# Altium schematic sheet Permanent_Storage.SchDoc
size 594 x 420 mm; SheetNumber: 1; SheetTotal: 4
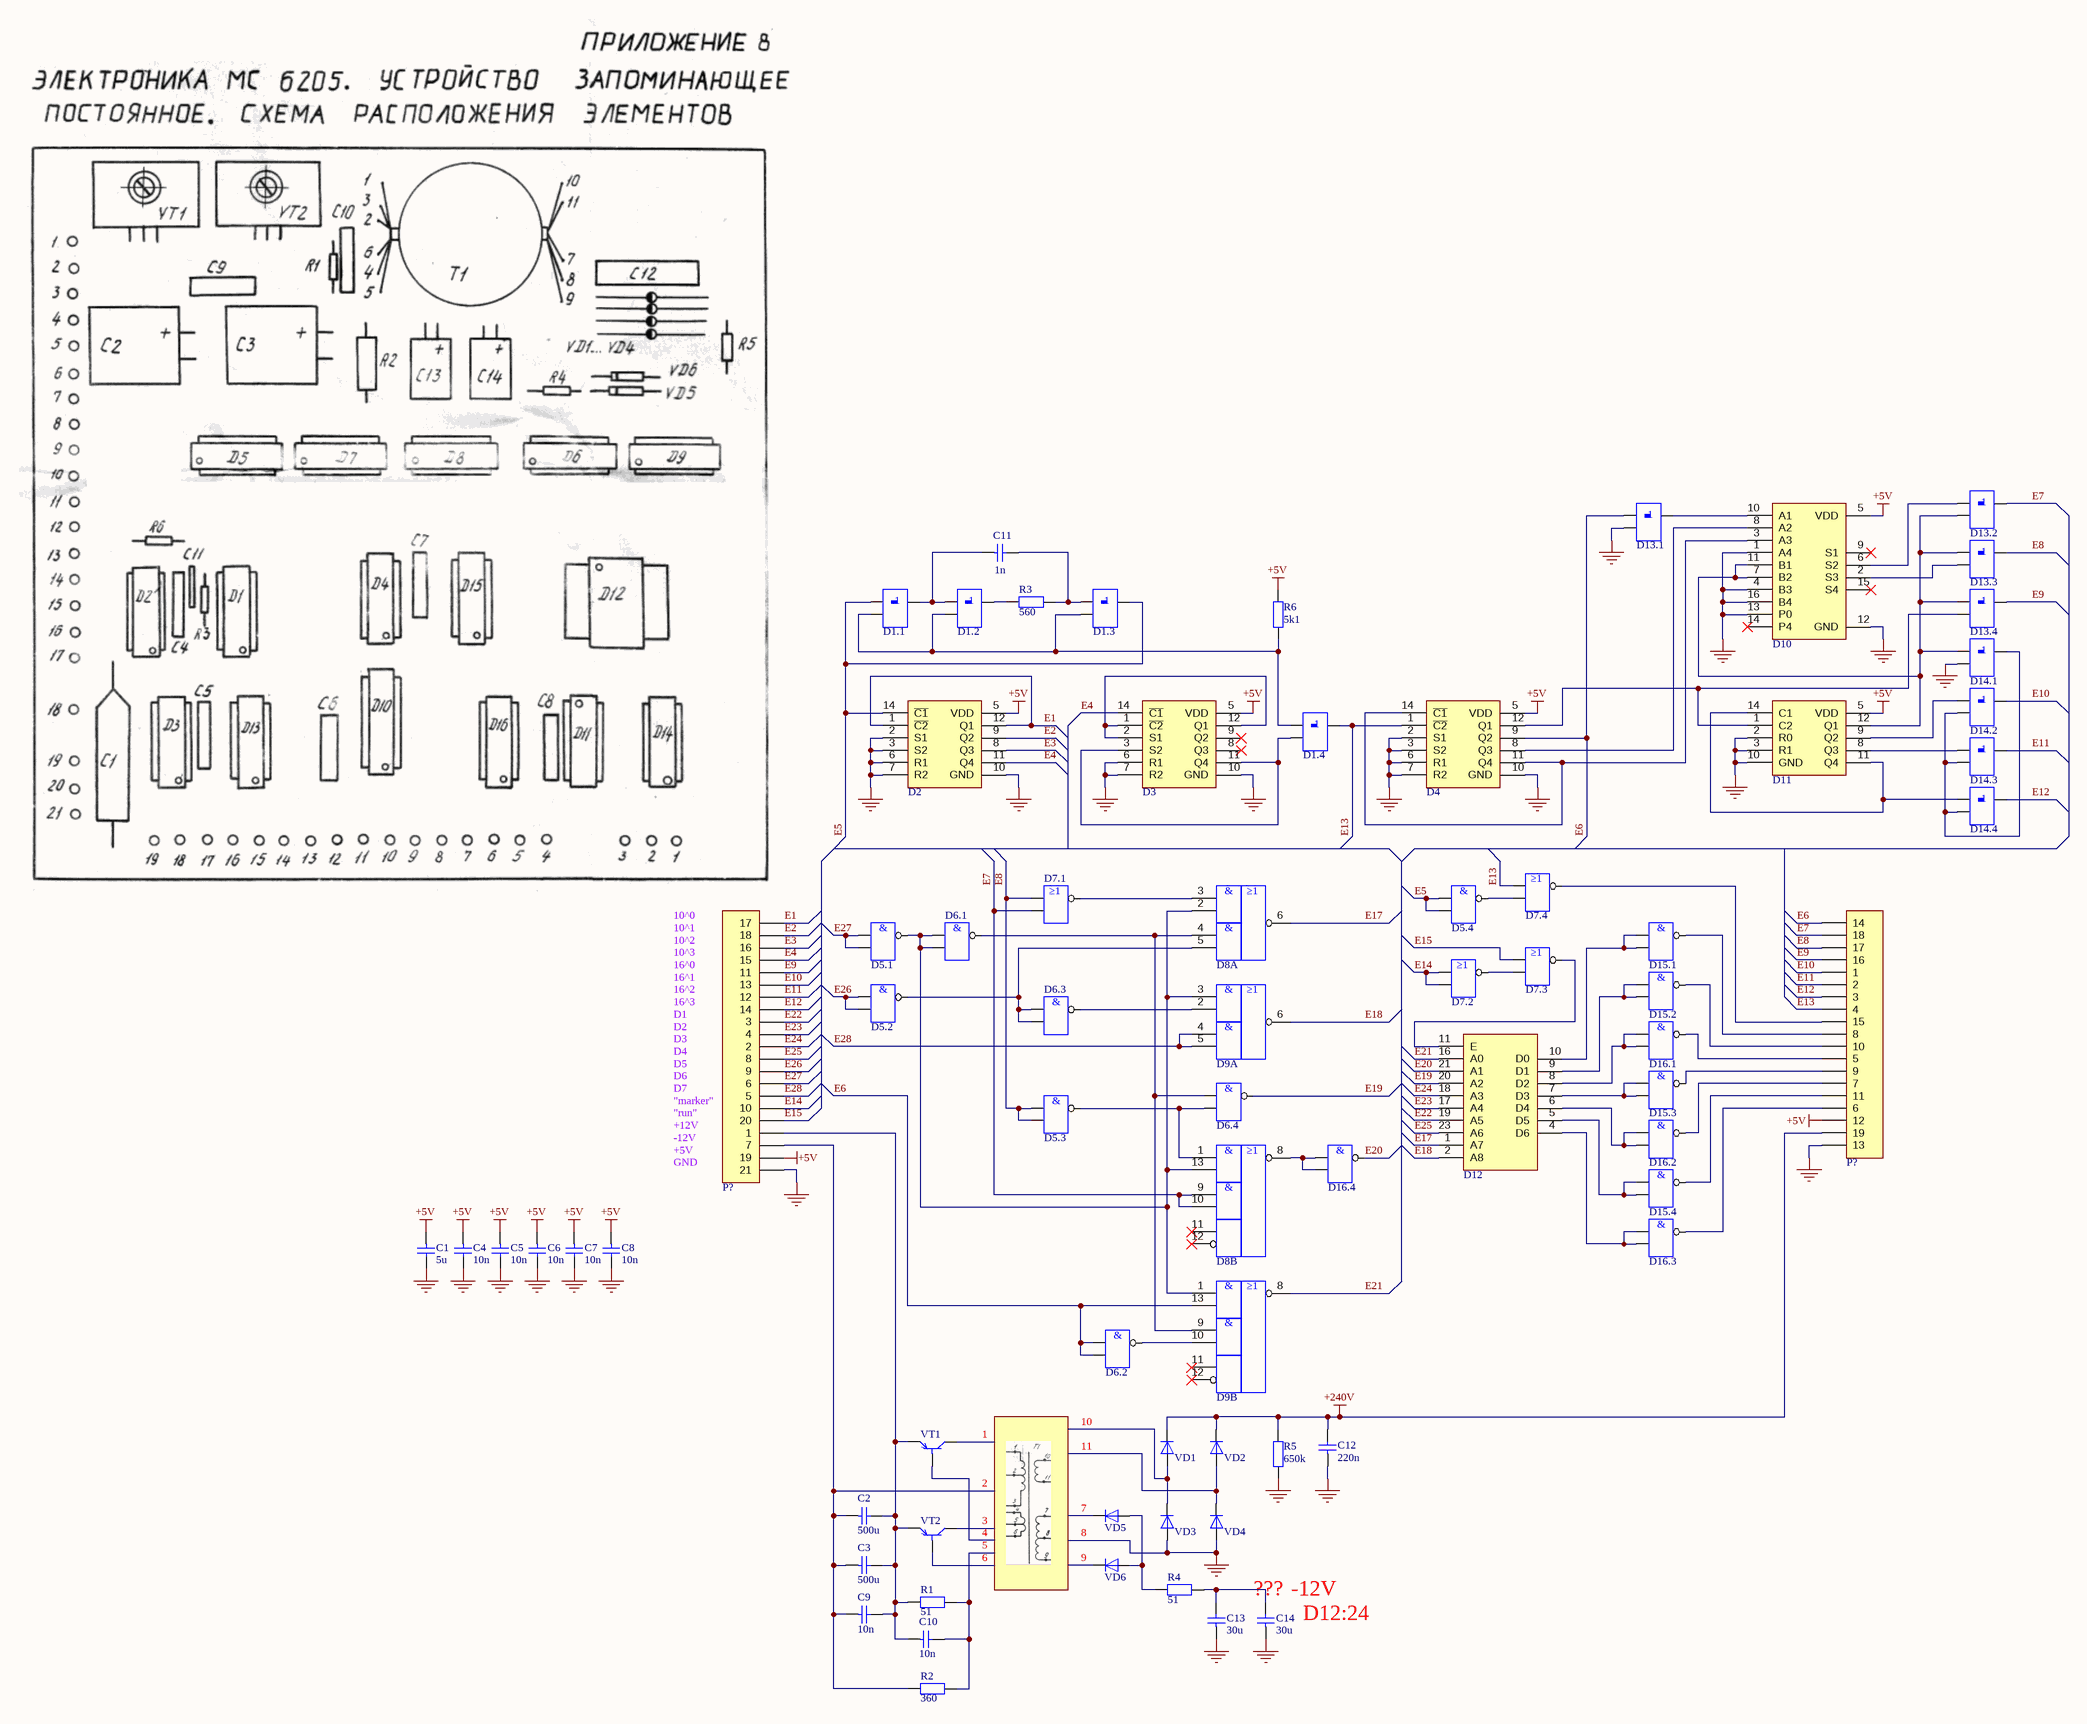
[diagram p0: Permanent_Storage.SchDoc]

## Parts
(Parts that share a designator on the sheet are numbered #1, #2 ... from top to bottom, then left to right.)
C1  5u
C2  500u
C3  500u
C4  10n
C5  10n
C6  10n
C7  10n
C8  10n
C9  10n
C10  10n
C11  1n
C12  220n
C13  30u
C14  30u
D1.1  -  (value not drawn)
D1.2  -  (value not drawn)
D1.3  -  (value not drawn)
D1.4  -  (value not drawn)
D2  -  (value not drawn)
D3  -  (value not drawn)
D4  -  (value not drawn)
D5.1  -  (value not drawn)
D5.2  -  (value not drawn)
D5.3  -  (value not drawn)
D5.4  -  (value not drawn)
D6.1  -  (value not drawn)
D6.2  -  (value not drawn)
D6.3  -  (value not drawn)
D6.4  -  (value not drawn)
D7.1  -  (value not drawn)
D7.2  -  (value not drawn)
D7.3  -  (value not drawn)
D7.4  -  (value not drawn)
D8  -  (value not drawn)  (parts A,B of 3)
D9  -  (value not drawn)  (parts A,B of 3)
D10  -  (value not drawn)
D11  -  (value not drawn)
D12  -  (value not drawn)
D13.1  -  (value not drawn)
D13.2  -  (value not drawn)
D13.3  -  (value not drawn)
D13.4  -  (value not drawn)
D14.1  -  (value not drawn)
D14.2  -  (value not drawn)
D14.3  -  (value not drawn)
D14.4  -  (value not drawn)
D15.1  -  (value not drawn)
D15.2  -  (value not drawn)
D15.3  -  (value not drawn)
D15.4  -  (value not drawn)
D16.1  -  (value not drawn)
D16.2  -  (value not drawn)
D16.3  -  (value not drawn)
D16.4  -  (value not drawn)
P?#1  -  (value not drawn)
P?#2  -  (value not drawn)
R1  51
R2  360
R3  560
R4  51
R5  650k
R6  5k1
VD1  -  (value not drawn)
VD2  -  (value not drawn)
VD3  -  (value not drawn)
VD4  -  (value not drawn)
VD5  -  (value not drawn)
VD6  -  (value not drawn)
VT1  -  (value not drawn)
VT2  -  (value not drawn)

## Nets
+5V: C1.2 C4.2 C5.2 C6.2 C7.2 C8.2 D2.5(VDD) D3.5(VDD) D4.5(VDD) D10.5(VDD) D11.5(VDD) P?#1.19 P?#2.12 R6.2
+240V: C12.1 P?#2.19 R5.2 VD1.1 VD2.1
GND: C1.1 C4.1 C5.1 C6.1 C7.1 C8.1 C12.2 C13.2 C14.2 D2.2(S1) D2.3(S2) D2.6(R1) D2.7(R2) D2.10(GND) D3.6(R1) D3.7(R2) D3.10(GND) D4.2(S1) D4.3(S2) D4.6(R1) D4.7(R2) D4.10(GND) D10.1(A4) D10.4(B3) D10.12(GND) D10.13(P0) D10.16(B4) D11.2(R0) D11.3(R1) D11.10(GND) D13.1.3(B1) D14.1.3(B1) P?#1.21 P?#2.13 R5.1 VD3.2 VD4.2
E1: D2.1(~{C2}) D2.12(Q1) P?#1.17
E2: D2.9(Q2) P?#1.18
E3: D2.8(Q3) P?#1.16
E4: D2.11(Q4) D3.14(~{C1}) P?#1.15
E5: D1.1.2(A1) D1.3.1(Y1) D2.14(~{C1}) D5.4.1 D5.4.2
E6: D4.9(Q2) D6.2.1 D6.2.2 D9.13(X6) D13.1.2(A1) P?#2.14
E7: D7.1.2 D8.9(X7) D8.10(X8) D13.2.1(Y1) P?#2.18
E8: D5.3.1 D5.3.2 D7.1.1 D13.3.1(Y1) P?#2.17
E9: D13.4.1(Y1) P?#1.11 P?#2.16
E10: D14.2.1(Y1) P?#1.13 P?#2.1
E11: D14.3.1(Y1) P?#1.12 P?#2.2
E12: D14.4.1(Y1) P?#1.14 P?#2.3
E13: D1.4.1(Y1) D4.1(~{C2}) D7.4.1 P?#2.4
E14: D7.2.1 D7.2.2 P?#1.10
E15: D7.3.1 P?#1.20
E17: D8.6(Y1) D12.1(A7)
E18: D9.6(Y1) D12.2(A8)
E19: D6.4.3 D12.20(A2)
E20: D12.21(A1) D16.4.3
E21: D9.8(Y2) D12.16(A0)
E22: D12.19(A5) P?#1.3
E23: D12.17(A4) P?#1.4
E24: D12.18(A3) P?#1.2
E25: D12.23(A6) P?#1.8
E26: D5.2.1 D5.2.2 P?#1.9
E27: D5.1.1 D5.1.2 P?#1.6
E28: D9.4(X3) D9.5(X4) P?#1.5
NetC2_1: C2.1 C3.1 C9.1 C10.2 P?#1.1 R1.1 VT1.2 VT2.2
NetC2_2: C2.2 C3.2 C9.2 P?#1.7 R2.1
NetC10_1: C10.1 R1.2 R2.2
NetC11_1: C11.1 D1.3.2(A1) R3.2
NetC11_2: C11.2 D1.1.1(Y1) D1.2.2(A1)
NetC13_1: C13.1 C14.1 R4.1
NetD1.1_3: D1.1.3(B1) D1.2.3(B1) D1.3.3(B1) D1.4.2(A1) R6.1
NetD1.2_1: D1.2.1(Y1) R3.1
NetD1.4_3: D1.4.3(B1) D3.3(S2) D3.11(Q4)
NetD3_1: D3.1(~{C2}) D3.2(S1) D3.12(Q1)
NetD4_8: D4.8(Q3) D10.8(A2)
NetD4_11: D4.11(Q4) D4.14(~{C1}) D10.3(A3)
NetD4_12: D4.12(Q1) D11.1(C2) D13.4.3(B1)
NetD5.1_3: D5.1.3 D6.1.1 D6.1.2 D8.2(X1) D8.13(X6) D9.1(X5) D9.3(X2)
NetD5.2_3: D5.2.3 D6.3.1 D6.3.2 D8.5(X4)
NetD5.3_3: D5.3.3 D6.4.2 D8.1(X5)
NetD5.4_3: D5.4.3 D7.4.2
NetD6.1_3: D6.1.3 D6.4.1 D8.4(X3) D9.9(X7)
NetD6.2_3: D6.2.3 D9.10(X8)
NetD6.3_3: D6.3.3 D9.2(X1)
NetD7.1_3: D7.1.3 D8.3(X2)
NetD7.2_3: D7.2.3 D7.3.2
NetD7.3_3: D7.3.3 D12.11(E)
NetD7.4_3: D7.4.3 P?#2.15
NetD8_8: D8.8(Y2) D16.4.1 D16.4.2
NetD10_2: D10.2(S3) D13.3.3(B1)
NetD10_6: D10.6(S2) D13.2.2(A1)
NetD10_7: D10.7(B2) D10.11(B1) D11.12(Q1) D13.2.3(B1) D13.3.2(A1) D13.4.2(A1) D14.1.2(A1)
NetD10_10: D10.10(A1) D13.1.1(Y1)
NetD11_8: D11.8(Q3) D14.3.2(A1)
NetD11_9: D11.9(Q2) D14.2.2(A1)
NetD11_11: D11.11(Q4) D11.14(C1) D14.4.2(A1)
NetD12_4: D12.4(D6) D16.3.1 D16.3.2
NetD12_5: D12.5(D5) D15.4.1 D15.4.2
NetD12_6: D12.6(D4) D16.2.1 D16.2.2
NetD12_7: D12.7(D3) D15.3.1 D15.3.2
NetD12_8: D12.8(D2) D16.1.1 D16.1.2
NetD12_9: D12.9(D1) D15.2.1 D15.2.2
NetD12_10: D12.10(D0) D15.1.1 D15.1.2
NetD14.1_1: D14.1.1(Y1) D14.2.3(B1) D14.3.3(B1) D14.4.3(B1)
NetD15.1_3: D15.1.3 P?#2.8
NetD15.2_3: D15.2.3 P?#2.10
NetD15.3_3: D15.3.3 P?#2.9
NetD15.4_3: D15.4.3 P?#2.11
NetD16.1_3: D16.1.3 P?#2.5
NetD16.2_3: D16.2.3 P?#2.7
NetD16.3_3: D16.3.3 P?#2.6
NetR4_2: R4.2 VD5.2 VD6.2
NetVD1_2: VD1.2 VD3.1
NetVD2_2: VD2.2 VD4.1

Not connected (* = marked no-connect by the designer): D3 8(Q3)* 9(Q2)*; D8 11(X9)* 12(X10)*; D9 11(X9)* 12(X10)*; D10 9(S1)* 14(P4)* 15(S4)*; VD5 1; VD6 1; VT1 1 3; VT2 1 3

## Notes on the sheet
- 10^0
- 10^1
- 16^0
- 16^1
- 16^2
- 10^2
- 10^3
- D1
- D2
- D3
- D4
- 16^3
- D5
- D6
- D7
- (near P?#1) "marker"
- "run"
- GND
- +12V
- -12V
- +5V
- 10
- (near VT1) 1
- 2
- 11
- (near VT2) 3
- (near VT2) 4
- (near VT2) 5
- (near VD5) 7
- 8
- 6
- (near VD6) 9
- (near C14) ???
- (near C14) -12V
- (near C14) D12:24
- DWG NO:
- REV:
- REVISION
- DESCRIPTION
- DATE
- APPROVED
- ENG:
- APPROVALS
- PROJECT
- DSN:
- CHK:
- REFERENCE DOCUMENTS
- PROJECT REVISION:
- TITLE
- DOCUMENT REVISION:
- DESIGN ITEM:
- BOM:
- FAB DWG:
- PCB DWG:
- ASSY DWG:
- SCALE:
- A2
- SIZE
- CAGE CODE
- FILE NAME
- DWG NO.
- SHEET
- OF
- REV
- (in symbol NAND) &
- (in symbol NOR) ≥1
- (in symbol К155ЛР1, part A) &; ≥1
- (in symbol К155ЛР1, part B) &; ≥1

## Library data of the parts
C1-C14 = C
D1.1-D1.4 D13.1-D13.4 D14.1-D14.4 = XOR
D2-D4 = К155ИЕ2: four digit decimal counter - https://kiloom.ru/spravochnik-radiodetalej/microsxema/k155ie2-km155ie2.html https://www.microshemca.ru/IE2/
D5.1-D5.4 D6.1-D6.4 D15.1-D15.4 D16.1-D16.4 = NAND
D7.1-D7.4 = NOR
D8 D9 = К155ЛР1: 2x 2x AND to 1x NOR - https://kiloom.ru/spravochnik-radiodetalej/microsxema/k155lr1-km155lr1-kb155lr1-4.html
D10 = К155ИМ3: 4-bit full adder - https://kiloom.ru/spravochnik-radiodetalej/microsxema/k155im3-km155im3.html
D11 = К155ИЕ5: binary counter - https://kiloom.ru/spravochnik-radiodetalej/microsxema/k155ie5-km155ie5.html
D12 = КР505РЕ3: some sort of ROM
P?#1 = 21x1_Connector_b
P?#2 = 19x1_Connector
R1-R6 = R
VD1-VD6 = D
VT1 VT2 = NPN